# Altium project Head_Mouse.PrjPcb
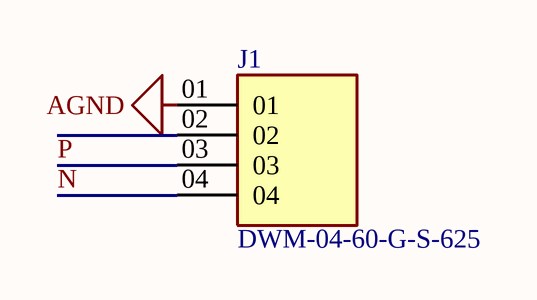
[diagram p0: Sheet1.SchDoc]
1 sheet, 1 parts. Net scope: global (net labels, ports and power ports of the same name join across sheets).
Board file: PCB1.PcbDoc

## Sheet Sheet1.SchDoc
size A4; SheetNumber: 1; SheetTotal: 1

### Parts
J1  DWM-04-60-G-S-625  [SAMTEC_DWM-04-60-G-S-625]

### Nets
AGND: J1.01
N: J1.04
P: J1.03

Not connected (* = marked no-connect by the designer): J1 02

### Library data of the parts
J1 = DWM-04-60-G-S-625: CONN BRD STACK .050 4POS; MF: Samtec; SnapEDA_Link: https://www.snapeda.com/parts/DWM-04-60-G-S-625/Samtec/view-part/?ref=snap; Package: None; Value: *; MP: DWM-04-60-G-S-625; Check_prices: https://www.snapeda.com/parts/DWM-04-60-G-S-625/Samtec/view-part/?ref=eda